# Altium schematic sheet mainboard_wifi.v1.3.SchDoc
size A4
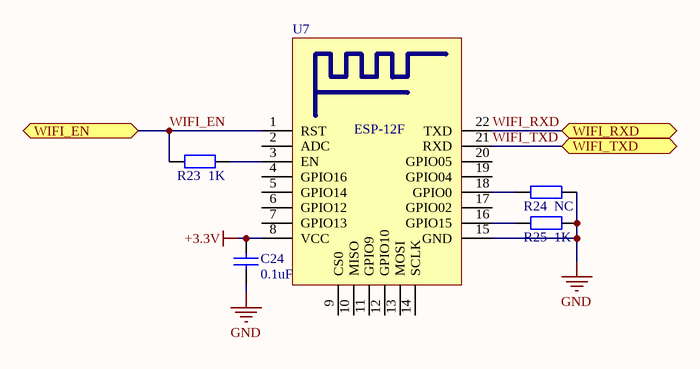
[diagram p0: mainboard_wifi.v1.3.SchDoc]

## Parts
C24  0.1uF  [0805]
R23  1K  [0805]
R24  NC  [0805]
R25  1K  [0805]
U7  ESP-12F  [ESP-12F]

## Ports
WIFI_EN, WIFI_RXD, WIFI_TXD

## Nets
+3.3V: C24.2 U7.8(VCC)
GND: C24.1 R24.2 R25.2 U7.15(GND)
WIFI_EN: R23.1 U7.1(RST) ; port WIFI_EN
WIFI_RXD: U7.22(TXD) ; port WIFI_RXD
WIFI_TXD: U7.21(RXD) ; port WIFI_TXD
NetR23_2: R23.2 U7.3(EN)
NetR24_1: R24.1 U7.18(GPIO0)
NetR25_1: R25.1 U7.16(GPIO15)

Not connected (* = marked no-connect by the designer): U7 2(ADC) 4(GPIO16) 5(GPIO14) 6(GPIO12) 7(GPIO13) 9(CS0) 10(MISO) 11(GPIO9) 12(GPIO10) 13(MOSI) 14(SCLK) 17(GPIO02) 19(GPIO04) 20(GPIO05)

## Library data of the parts
C24 = Cap: Capacitor
R23-R25 = Res2: Resistor